# EAGLE design RelayCTRL (EAGLE 9.3.1)
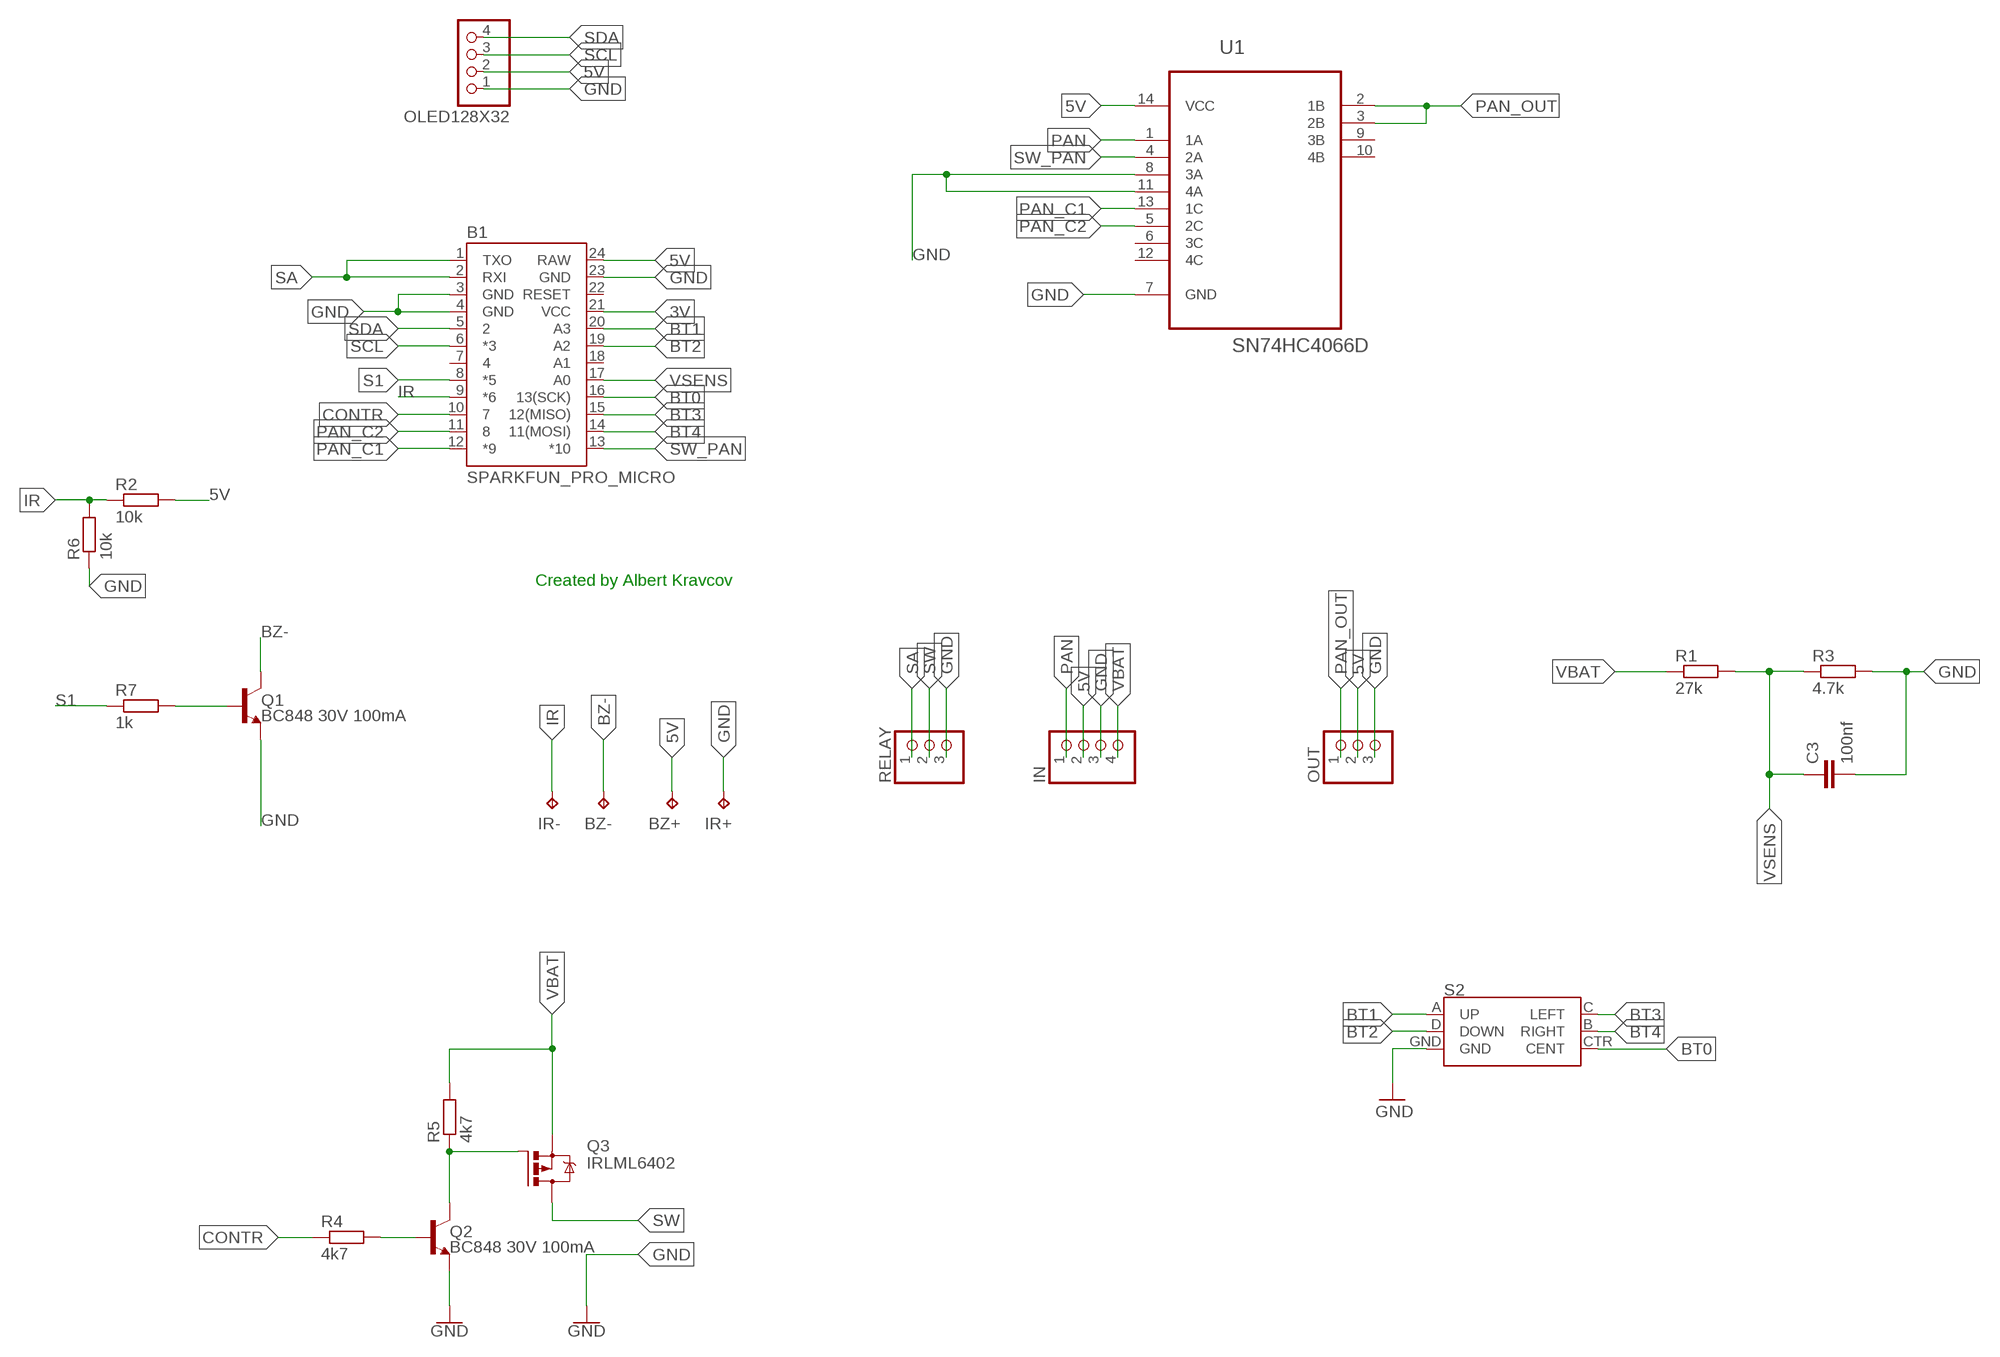
[diagram p0: schematic, sheet 1]

## Parts
B1  SPARKFUN_PRO_MICRO  [SPARKFUN_PRO_MICRO]
BZ+  TPTP15R  [TP15R]
BZ-  TPTP15R  [TP15R]
C3  100nf  C-EUC1206  [C1206]
IN  PINHD-1X4  [1X04]
IR+  TPTP15R  [TP15R]
IR-  TPTP15R  [TP15R]
OLED128X32  PINHD-1X4  [1X04]
OUT  PINHD-1X3  [1X03]
Q1  BC848 30V 100mA  TRANS_NPN-MMBT2222AL  [SOT23-3]
Q2  BC848 30V 100mA  TRANS_NPN-MMBT2222AL  [SOT23-3]
Q3  IRLML6402  IRLML5203  [MICRO3]
R1  27k  R-EU_R1206  [R1206]
R2  10k  R-EU_R0603  [R0603]
R3  4.7k  R-EU_R1206  [R1206]
R4  4k7  R-EU_R0603  [R0603]
R5  4k7  R-EU_R0603  [R0603]
R6  10k  R-EU_R0603  [R0603]
R7  1k  R-EU_R0603  [R0603]
RELAY  PINHD-1X3  [1X03]
S2  JOYSTICK_MINI  [JOYSTICK_MINI]
U1  SN74HC4066D  [SOIC127P600X175-14N]

## Nets
3V: B1.21(VCC)
5V [medium]: B1.24(RAW) BZ+.TP IN.2 OLED128X32.2 OUT.2 R2.2 U1.14(VCC)
BT0: B1.16(13(SCK)) S2.CTR(CENT)
BT1: B1.20(A3) S2.A(UP)
BT2: B1.19(A2) S2.D(DOWN)
BT3: B1.15(12(MISO)) S2.C(LEFT)
BT4: B1.14(11(MOSI)) S2.B(RIGHT)
BZ-: BZ-.TP Q1.3(C)
CONTR: B1.10 R4.1
GND: B1.3(GND) B1.4(GND) B1.23(GND) C3.2 IN.3 IR+.TP OLED128X32.1 OUT.3 Q1.2(E) Q2.2(E) R3.2 R6.1 RELAY.3 S2.GND U1.7(GND) U1.8(3A) U1.11(4A)
IR: B1.9(*6) IR-.TP R2.1 R6.2
N$3: Q2.1(B) R4.2
N$4: Q2.3(C) Q3.1(G) R5.1
N$5: Q1.1(B) R7.2
PAN: IN.1 U1.1(1A)
PAN_C1: B1.12(*9) U1.13(1C)
PAN_C2: B1.11 U1.5(2C)
PAN_OUT: OUT.1 U1.2(1B) U1.3(2B)
S1: B1.8(*5) R7.1
SA: B1.1(TXO) B1.2(RXI) RELAY.1
SCL: B1.6(*3) OLED128X32.3
SDA: B1.5 OLED128X32.4
SW [medium]: Q3.3(D) RELAY.2
SW_PAN: B1.13(*10) U1.4(2A)
VBAT: IN.4 Q3.2(S) R1.1 R5.2
VSENS: B1.17(A0) C3.1 R1.2 R3.1
Unconnected: B1.7 B1.18(A1) B1.22(RESET) U1.6(3C) U1.9(3B) U1.10(4B) U1.12(4C)

## Notes on the sheet
- Created by Albert Kravcov

## Library data of the parts
B1 = SparkFun-Boards:SPARKFUN_PRO_MICRO: SparkFun Pro Micro Atmega32U4 compatible footprint. SparkFun Products: 3.3V/8MHz <https://www.sparkfun.com/products/12587> 5V/16MHz <https://www.sparkfun.com/products/12640>
BZ+ BZ- IR+ IR- = testpad:TP: Test pad
C3 = rcl:C-EU: CAPACITOR, European symbol; SPICEPREFIX: C
IN OLED128X32 = pinhead:PINHD-1X4: PIN HEADER
OUT RELAY = pinhead:PINHD-1X3: PIN HEADER
Q1 Q2 = SparkFun-DiscreteSemi:TRANS_NPN: NPN transistor Current controlled devices typically used to amplify current or used as a switch. BC547 - COM-08928 <http://www.sparkfun.com/products/8928> (TO-92 45V 100mA) (1.Collector 2.Base 3.Emitter) 2N3904 - COM-00521 <http://www.sparkfun.com/products/521> (TO-92 40V 200mA) (1.Emitter 2.Base 3.Collector) P2N2222A - COM-12852 <http://www.sparkfun.com/products/12852> (TO-92 40V 600mA) (1.Collector 2.Base 3.Emitter); PROD_ID: TRANS-08049; VALUE: 600mA/40V
Q3 = transistor-power:IRLML5203: HEXFET P-Channel Power MOSFET
R1-R3 R6 R7 = rcl:R-EU_: RESISTOR, European symbol; SPICEPREFIX: R
R4 R5 = resistor:R-EU_: RESISTOR, European symbol
S2 = SparkFun-Switches:JOYSTICK_MINI: Small Tactile Joystick w/ Select Switch A 5-way tactile switch allows for a joystick-like interface in a very small package. Part #: 4UCON SF303GJ26 SparkFun Products 5-way Tactile Switch <https://www.sparkfun.com/products/10063> (COM-10063) Used on SparkFun Block for Intel® Edison - OLED <https://www.sparkfun.com/products/13035> (DEV-13035) Used on CAN-BUS Shield <https://www.sparkfun.com/products/13262> (DEV-13262); PROD_ID: SWCH-09905; SF_SKU: COM-10063
U1 = SN74HC4066D:SN74HC4066D: QUADRUPLE BILATERAL ANALOG SWITCH; AVAILABILITY: Unavailable; DESCRIPTION: 4 Circuit IC Switch 1:1 30Ohm _Typ_ 14-SOIC; MF: Texas Instruments; MP: SN74HC4066D; PACKAGE: SOIC-14 Texas Instruments; PRICE: None

## Net classes
0 default: width 0.2 mm, drill 0.254 mm, clearance 0.22 mm
2 medium: width 0.305 mm, drill 0.3 mm, clearance 0.305 mm

## Board
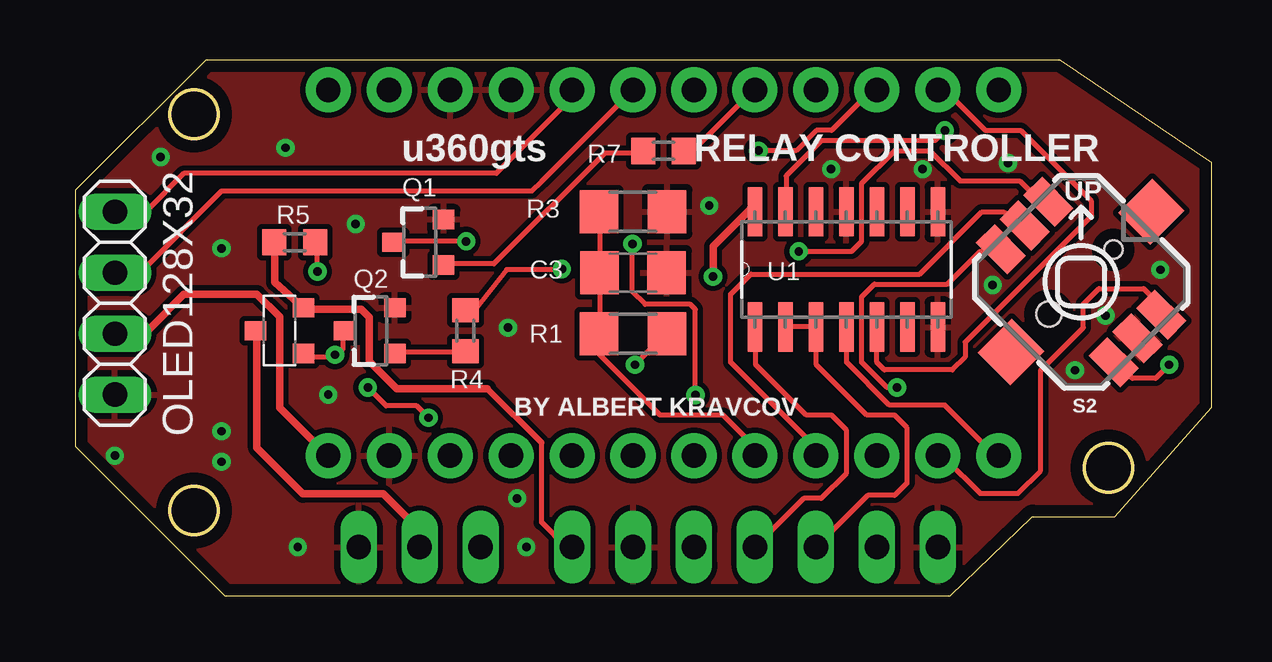
[diagram p1: board, top side]
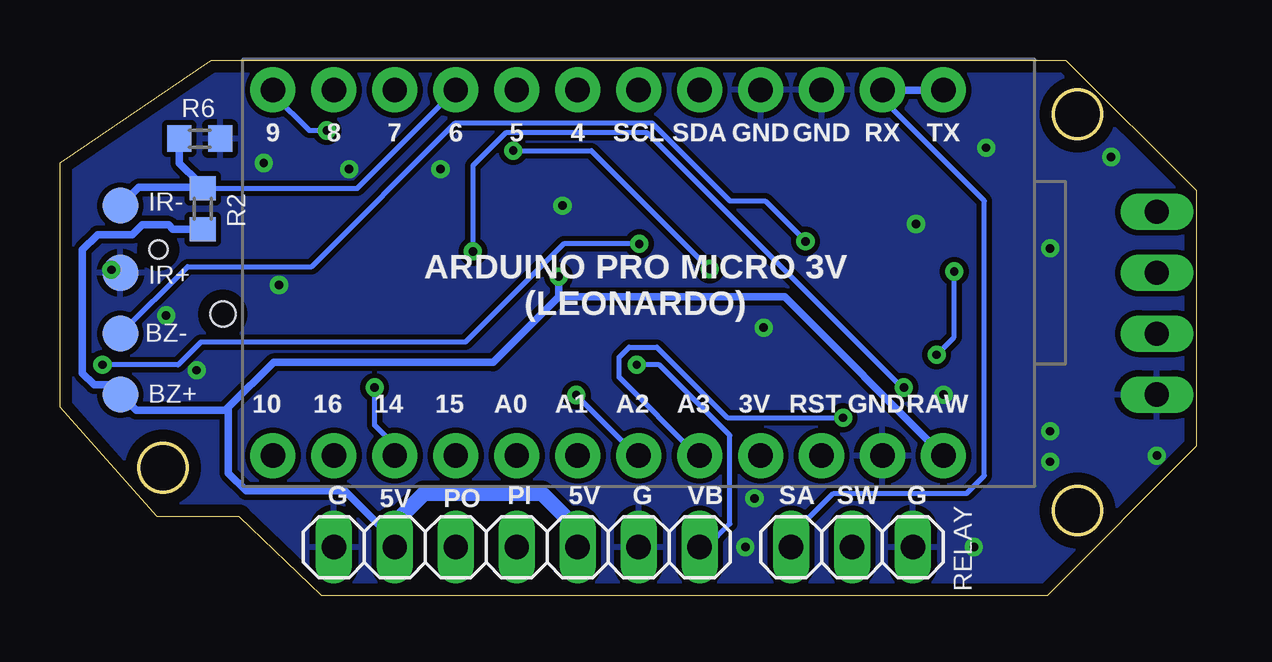
[diagram p2: board, bottom side, seen from below]

Size 47.35 x 22.33 mm. Coordinates in mm from the lower left corner, seen from the top.
Outline: 0,16.89 0,6.22 6.22,0 36.45,0 39.88,3.3 43.31,3.3 47.35,7.85 47.35,18.05 41.05,22.33 5.44,22.33 0,16.89
Outline: circle at 4.95,20.07 radius 1
Outline: circle at 43.05,5.33 radius 1
Outline: circle at 4.95,3.56 radius 1
Copper layers (1*16): Top 0.035mm / dielectric 1.5mm / Bottom 0.035mm
Design rules "default *": minimum track width 6mil, minimum drill 0.35mm, track to track 6mil, track to pad 6mil, pad to pad 6mil, via to via 6mil, smd to smd 6mil, copper to edge 0.5mm, drill to drill 6mil, minimum pad ring 10mil, minimum via ring 8mil, stop-mask expansion 4mil, vias tented up to drill 2mm, thermal gap 10mil

### Footprints (pad centres in the part's own frame; a part is rotated, then mirrored left to right if it is on the bottom)
SPARKFUN_PRO_MICRO = drill 1.016 pad 1.88: 1 -7.62,12.7; 2 -7.62,10.16; 3 -7.62,7.62; 4 -7.62,5.08; 5 -7.62,2.54; 6 -7.62,0; 7 -7.62,-2.54; 8 -7.62,-5.08; 9 -7.62,-7.62; 10 -7.62,-10.16; 11 -7.62,-12.7; 12 -7.62,-15.24; 13 7.62,-15.24; 14 7.62,-12.7; 15 7.62,-10.16; 16 7.62,-7.62; 17 7.62,-5.08; 18 7.62,-2.54; 19 7.62,0; 20 7.62,2.54; 21 7.62,5.08; 22 7.62,7.62; 23 7.62,10.16; 24 7.62,12.7
TP15R = smd 1.5 x 1.5: TP 0,0
C1206 = smd 1.6 x 1.8: 1 -1.4,0; 2 1.4,0
1X04 = drill 1.016 long: 1 -3.81,0; 2 -1.27,0; 3 1.27,0; 4 3.81,0
1X03 = drill 1.016 long: 1 -2.54,0; 2 0,0; 3 2.54,0
SOT23-3 = smd 0.8 x 0.9: 1 -0.95,-1; 2 0.95,-1; 3 0,1.1
MICRO3 = smd 0.8 x 0.9: 1 -0.95,-1; 2 0.95,-1; 3 0,1
R1206 = smd 1.6 x 1.803: 1 -1.422,0; 2 1.422,0
R0603 = smd 1 x 1.1: 1 -0.85,0; 2 0.85,0
JOYSTICK_MINI = smd 1.85 x 1.1: A -3.325,1.4; B 3.325,1.4; C -3.325,-1.4; CTR -3.325,0; D 3.325,-1.4; GND 3.325,0 | smd 1.9 x 2: NC 0,4.13; NC@0 0,-4.13 | hole 0.75: 0,1.9 | hole 1.05: 0,-1.9
SOIC127P600X175-14N = smd 2.057 x 0.61: 1 -4.801,7.62; 2 -4.801,6.35; 3 -4.801,5.08; 4 -4.801,3.81; 5 -4.801,2.54; 6 -4.801,1.27; 7 -4.801,0; 8 0,0; 9 0,1.27; 10 0,2.54; 11 0,3.81; 12 0,5.08; 13 0,6.35; 14 0,7.62

### Placement (x,y rotation side)
B1  23.24,13.46 270 bottom
BZ+  44.83,8.38 0 bottom
BZ-  44.83,10.92 0 bottom
C3  23.24,13.46 0 top
IN  24.51,2.03 0 bottom
IR+  44.83,13.46 0 bottom
IR-  44.83,16.26 0 bottom
OLED128X32  1.65,12.19 90 top
OUT  33.4,2.03 180 bottom
Q1  14.35,14.73 90 top
Q2  12.32,11.05 90 top
Q3  8.51,11.05 90 top
R1  23.24,10.92 180 top
R2  41.4,16.13 270 bottom
R3  23.24,16 0 top
R4  16.26,11.05 270 top
R5  9.14,14.73 180 top
R6  41.53,19.05 180 bottom
R7  24.51,18.54 180 top
RELAY  14.35,2.03 0 bottom
S2  41.91,13.08 315 top
U1  35.94,16 90 top

### Tracks (layer width: path | path; a pad name or v marks a point on that pad's centre or on a via)
5V  (via drill 0.35)
  Top 0.305: 27.94,15.93 28.26,15.93 U1.14 | 27.94,15.93 26.58,14.56 v26.58,13.3 | 27.94,15.93 28.28,16.27 | 2.64,10.99 1.69,10.99 OLED128X32.2 2.74,11.1 3.06,11.1 4.53,12.57 7.57,12.57 8.52,11.62 8.52,7.84 10.51,5.85 B1.24
  Bottom 0.305: v26.58,13.3 26.58,12.46 | OUT.2 33.4,2.3 35.48,4.38 39.6,4.38 40.33,5.11 40.33,7.85 | 40.33,7.85 38.45,9.73 29.31,9.73 26.58,12.46 | 40.33,7.85 40.46,7.73 44.17,7.73 BZ+.TP 45.24,8.79 45.93,8.79 46.42,9.28 46.42,14.42 45.78,15.05 44.33,15.05 43.93,15.45 42.83,15.45 42.66,15.28 R2.2 | B1.24 17.16,12.46 26.58,12.46
  Bottom 0.635: IN.2 25.78,2.77 27.28,4.27 32.18,4.27 33.4,3.05 OUT.2
BT0
  Top 0.2: S2.CTR 39.49,15.51 39.18,15.51 38.68,16 37.78,16 35.19,13.41 28.15,13.41 27.31,12.57 27.31,9.73 30.78,6.27 30.78,5.85 B1.16
BT1  (via drill 0.35)
  Top 0.2: v30.15,14.35 32.35,14.35 32.77,14.77 32.77,17.19 34.14,18.55 35.61,18.55 36.87,17.29 39.35,17.29 40.19,16.45 40.54,16.45 S2.A | v14.72,7.42 14.22,7.92 12.95,7.92 v12.19,8.68
  Bottom 0.2: v30.15,14.35 30.15,17.92 28.78,19.29 22.88,19.29 12.27,8.68 v12.19,8.68 | v14.72,7.42 19.54,7.42 22.48,10.36 23.64,10.36 24.06,9.94 24.06,9.1 20.8,5.85 B1.20
BT2  (via drill 0.35)
  Top 0.2: v45.58,9.63 45.02,9.06 44.05,9.06 43.38,9.73 S2.D | v23.22,14.67 23.22,12.67 23.74,12.15 25.63,12.15 25.84,11.94 v25.84,8.37
  Bottom 0.2: v45.58,9.63 42.43,9.63 41.49,10.57 30.46,10.57 26.37,14.67 v23.22,14.67 | v25.84,8.37 23.32,5.85 B1.19
BT3  (via drill 0.35)
  Top 0.2: v34.24,8.68 33.82,8.68 32.77,9.73 32.77,12.46 33.3,12.99 36.34,12.99 37.71,14.35 38.55,14.35 S2.C
  Bottom 0.2: v34.24,8.68 34.24,7.11 33.4,6.27 B1.15
BT4
  Top 0.2: S2.B 45.25,12.06 44.51,12.8 42.65,12.8 42.17,12.32 42.07,12.22 42,12.15 42,11.18 40.23,9.4 40.23,5.22 39.28,4.27 37.71,4.27 36.24,5.74 36.03,5.74 B1.14
BZ-  (via drill 0.35)
  Top 0.2: v16.29,14.77 13.35,14.77 Q1.3
  Bottom 0.2: v16.29,14.77 17.97,16.45 19.44,16.45 22.69,19.71 30.88,19.71 36.87,13.72 42.03,13.72 BZ-.TP
CONTR  (via drill 0.35)
  Top 0.2: v20.28,13.62 20.25,13.59 17.97,13.59 16.64,11.9 R4.1 | v28.47,18.55 30.04,18.55 30.88,19.39 31.51,19.39 33.19,21.07 B1.10
  Bottom 0.2: v20.28,13.62 25.21,18.55 v28.47,18.55
GND  (via drill 0.35)
  other vias: 6.1,5.59 1.65,5.84 6.1,6.86 9.27,2.03 38.86,18.03 35.31,17.78 38.23,12.95 26.42,16.26 11.68,15.49 10.54,8.38 18.03,11.18 18.8,2.03 8.76,18.67 3.56,18.29 6.1,14.48 41.66,9.4 42.93,11.68 18.41,4.06 31.5,17.78 45.21,13.59
  pour Top: -2.16,23.62 53.72,23.62 53.72,-14.48 -2.16,-14.48
  pour Bottom: -2.16,24.89 47.37,24.89 47.37,-8.13 -2.16,-8.13
IR
  Bottom 0.2: 44.83,15.62 IR-.TP | 41.44,17.02 R2.1 34.96,16.98 B1.9
  Bottom 0.305: IR-.TP 44.07,17.02 41.57,17.02 | 41.44,17.02 41.57,17.02 | 41.57,17.02 41.57,17.22 42.38,18.03 R6.2
N$3
  Top 0.2: Q2.1 13.35,10.15 16.18,10.15 R4.2
N$4  (via drill 0.35)
  Top 0.2: 10.88,9.99 11.14,10.26 11.14,10.99 Q2.3 | 10.88,9.99 10.83,9.94 9.68,9.94 Q3.1 | v10.09,13.51 10.09,14.67 R5.1 | v10.83,10.05 10.88,9.99
  Bottom 0.2: v10.09,13.51 10.09,10.78 v10.83,10.05
N$5
  Top 0.2: Q1.1 15.45,13.83 17.44,13.83 22.06,18.45 23.64,18.45 R7.2
PAN
  Top 0.2: U1.1 28.36,11.1 28.36,9.63 30.46,7.53 31.51,7.53 32.14,6.9 32.14,5.12 31.08,4.06 30.35,4.06 IN.1
PAN_C1  (via drill 0.35)
  Top 0.2: v36.24,19.39 35.82,18.97 31.09,18.97 29.62,17.5 29.62,16.03 U1.13
  Bottom 0.2: v36.24,19.39 36.97,19.39 38.44,20.86 38.44,21.07 B1.12
PAN_C2
  Top 0.2: U1.5 33.4,9.73 33.72,9.42 36.55,9.42 37.08,9.94 37.08,10.57 42.33,15.82 42.33,16.45 39.39,19.39 37.92,19.39 36.23,21.08 B1.11
PAN_OUT
  Top 0.2: U1.2 29.62,11.2 30.78,11.2 U1.3 30.88,11.1 30.88,9.63 32.98,7.53 34.14,7.53 34.66,7 34.66,4.71 34.14,4.19 33.02,4.19 OUT.1
S1
  Top 0.2: R7.1 25.42,18.55 25.74,18.55 28.26,21.07 B1.8
SA
  Bottom 0.2: RELAY.1 16.81,2.07 16.81,2.59 15.13,4.27 9.57,4.27 8.83,5.01 8.83,16.45 13.03,20.65 13.03,21.07 B1.2
  Bottom 0.305: B1.1 13.03,21.07
SCL
  Top 0.2: OLED128X32.3 1.69,13.51 2.74,13.51 6.1,16.87 19.03,16.87 19.43,17.27 B1.6
SDA
  Top 0.2: OLED128X32.4 1.69,16.03 2.95,16.03 4.53,17.61 17.55,17.61 20.7,20.76 B1.5
SW
  Top 0.305: Q3.3 7.57,10.99 7.57,6.16 9.48,4.25 12.84,4.25 14.29,2.8 14.29,2.07 14.32,2.07 RELAY.2
SW_PAN
  Top 0.2: U1.4 32.14,11.1 32.14,9.73 33.93,7.95 36.24,7.95 38.44,5.74 B1.13
VBAT  (via drill 0.35)
  Top 0.2: v23.32,9.63 24.58,10.89 R1.1 | 8.32,14.11 8.31,14.12 8.31,14.67 R5.2 | IN.4 20.47,2.03 | 9.57,11.94 Q3.2
  Top 0.203: 19.44,3.06 19.44,6.37
  Top 0.229: 19.44,6.37 17.18,8.63 | 20.47,2.03 19.44,3.06
  Top 0.305: 8.32,14.11 8.32,13.07 Q3.2 | 9.57,11.94 11.92,11.94 12.25,11.61 12.25,9.78 13.4,8.63 17.18,8.63
  Bottom 0.2: v23.32,9.63 22.38,9.63 19.44,6.69 19.44,3 | IN.4 20.41,2.03
  Bottom 0.203: 20.41,2.03 19.44,3
VSENS
  Top 0.2: R3.1 21.85,15.93 21.85,13.51 C3.1 21.85,13.41 21.85,10.99 R1.2 21.85,10.89 21.85,10.05 24.37,7.53 27,7.53 28.26,6.27 28.26,5.85 B1.17

### Text on the board
tNames: u360gts RELAY CONTROLLER | BY ALBERT KRAVCOV
bNames: TX | RX | GND | GND | SDA | SCL | 4 | 5 | 6 | 7 | 8 | 9 | ARDUINO PRO MICRO 3V / (LEONARDO) | RAW | GND | RST | 3V | A3 | A2 | A1 | A0 | 15 | 14 | 16 | 10 | G | SW | SA | VB | G | 5V | PI | PO | 5V | G